# Altium schematic sheet ADC5G_FRONTEND.SchDoc: FMC 5GS/s ADC/TDC
size 420 x 297 mm; Author: Agnieszka Bartkowicz; CompanyName: WUT ISE; DrawnBy: Agnieszka Bartkowicz; Engineer: Agnieszka Bartkowicz; Organization: WUT ISE; Address1: PW ISE; Address2: Nowowiejska 15/19 00-665 Warsaw; Address3: gyorka@o2.pl; SheetNumber: 3; SheetTotal: 14; ModifiedBy: -; CheckedDate: -; Title2: Title 2; DivGrp: WUT ISE; Designer: A. Bartkowicz
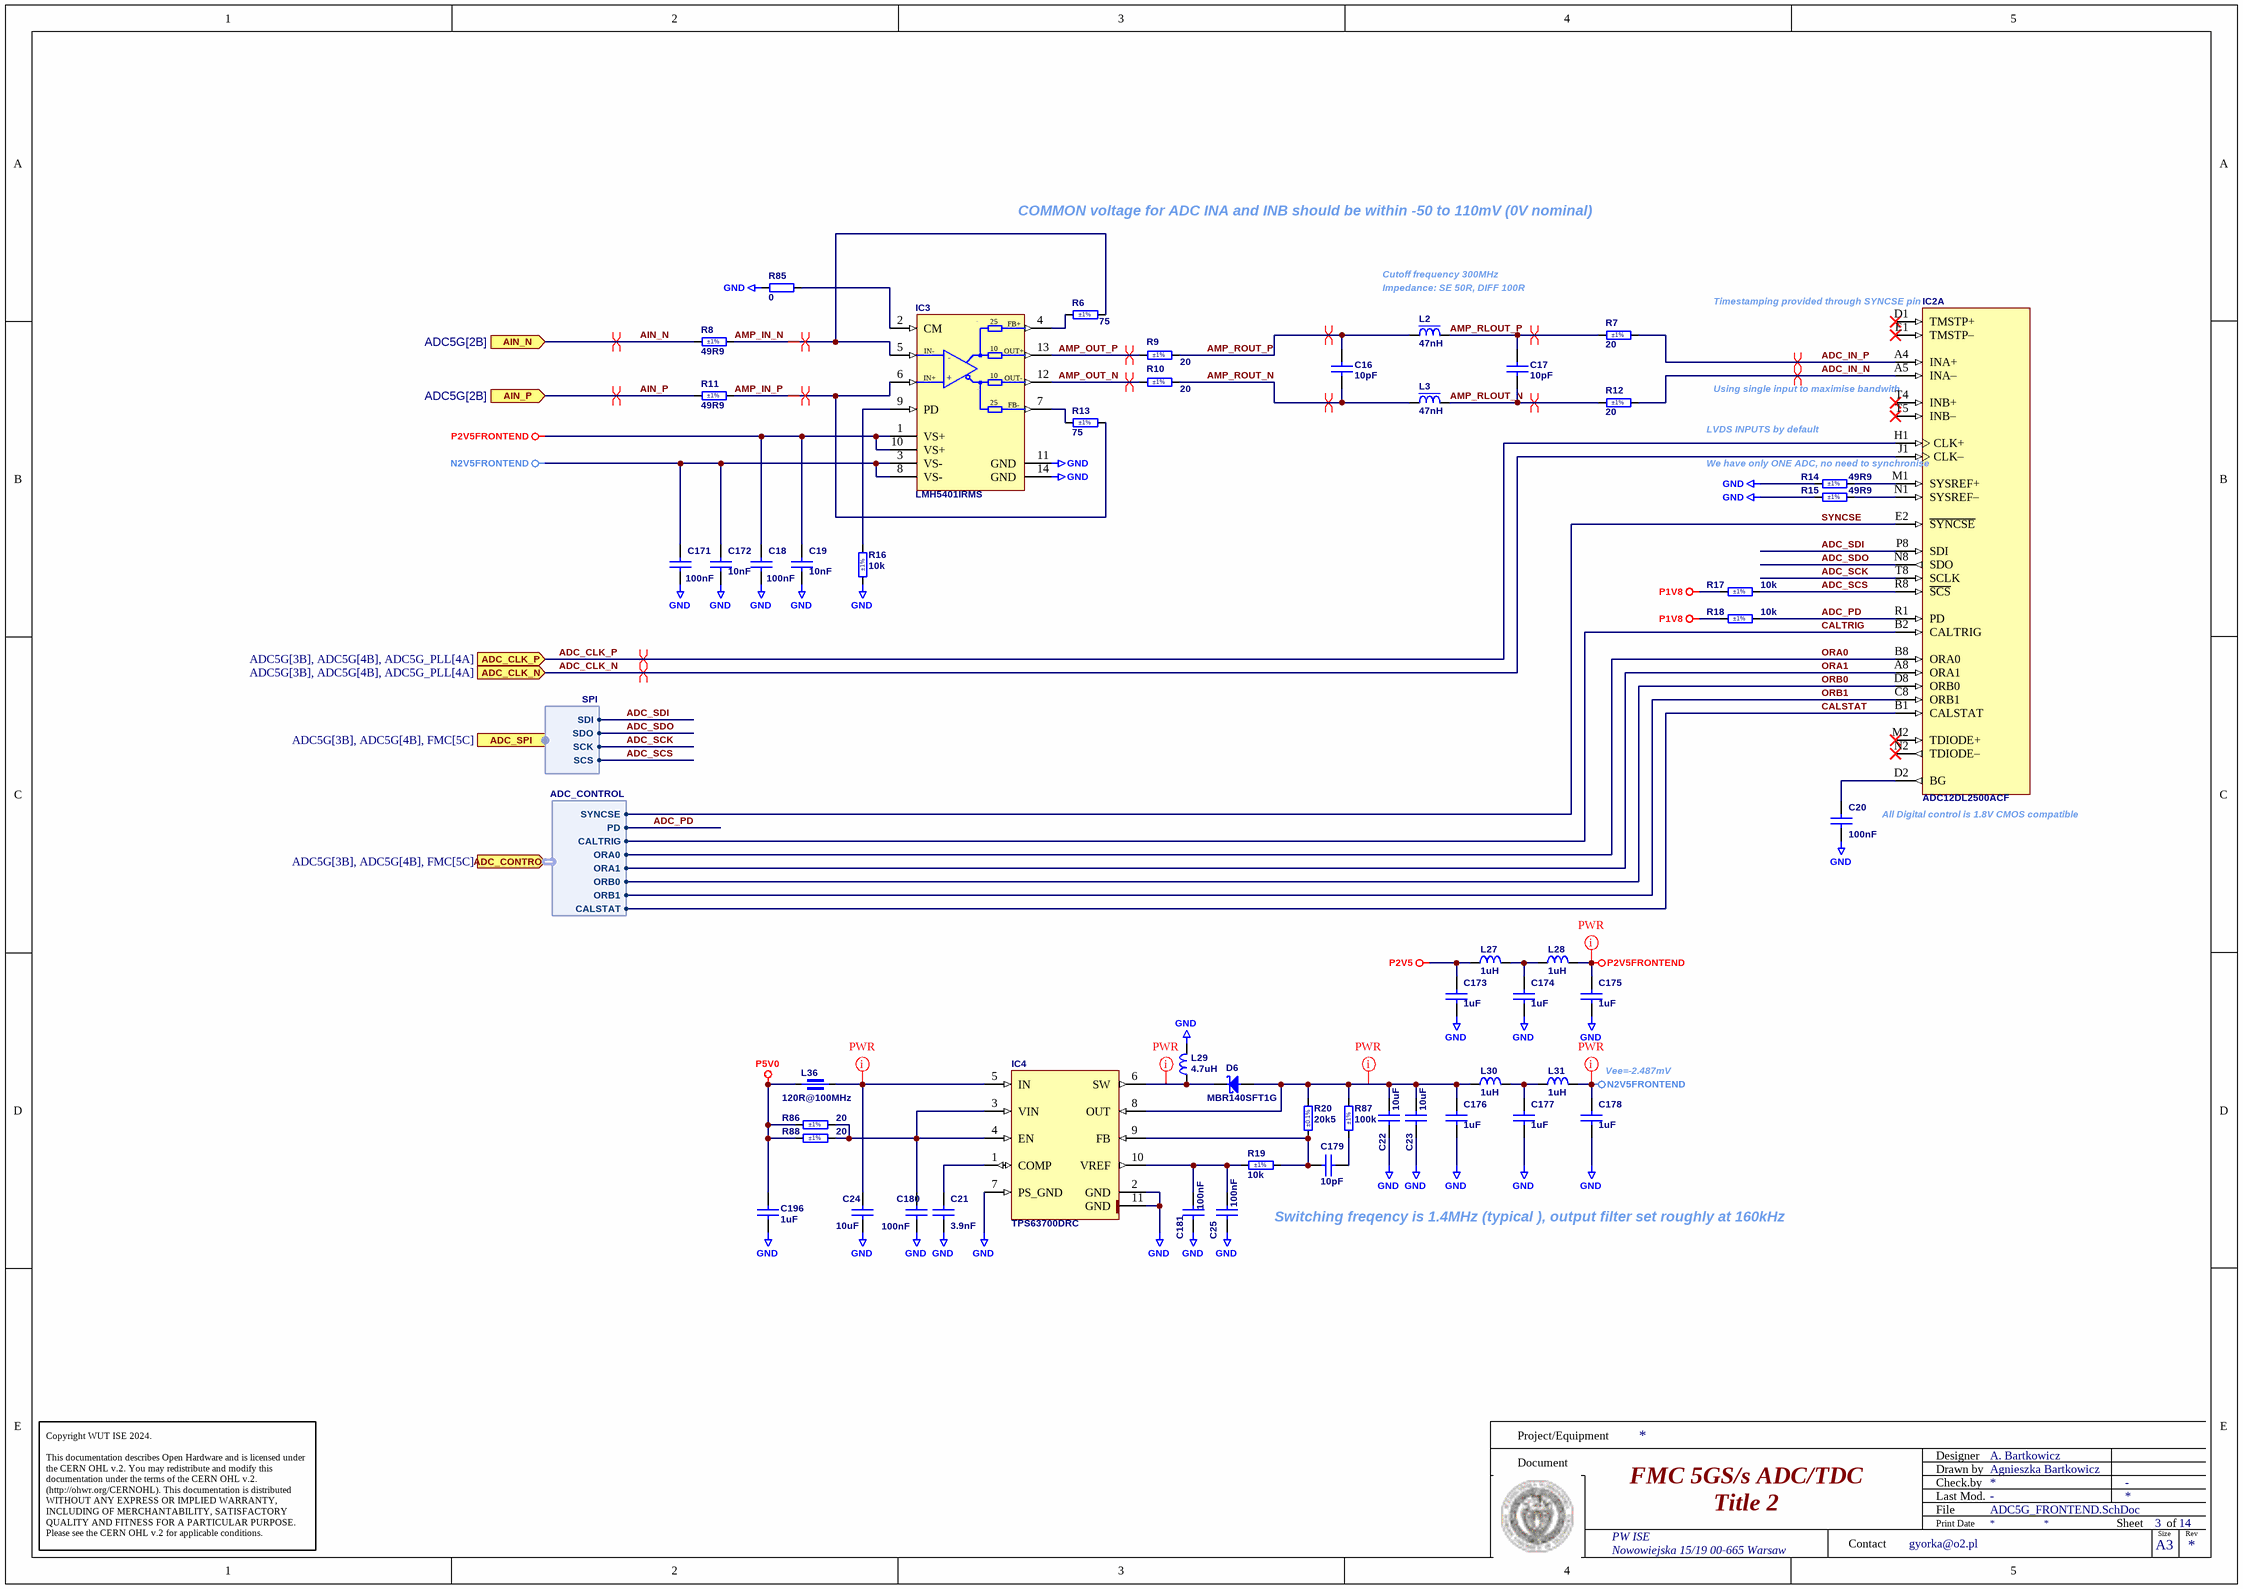
[diagram p0: ADC5G_FRONTEND.SchDoc]

## Parts
C16  10pF  [CAPC1005X55N]
C17  10pF  [CAPC1005X55N]
C18  100nF  [CAPC1005X55N]
C19  10nF  [CAPC1005X55N]
C20  100nF  [CAPC0603X33N]
C21  3.9nF  [CAPC1005X55N]
C22  10uF  [CAPC1608X90N]
C23  10uF  [CAPC1608X90N]
C24  10uF  [CAPC1608X90N]
C25  100nF  [CAPC1005X55N]
C171  100nF  [CAPC1005X55N]
C172  10nF  [CAPC1005X55N]
C173  1uF  [CAPC1005X55N]
C174  1uF  [CAPC1005X55N]
C175  1uF  [CAPC1005X55N]
C176  1uF  [CAPC1005X55N]
C177  1uF  [CAPC1005X55N]
C178  1uF  [CAPC1005X55N]
C179  10pF  [CAPC1005X55N]
C180  100nF  [CAPC1005X55N]
C181  100nF  [CAPC1005X55N]
C196  1uF  [CAPC1005X55N]
D6  MBR140SFT1G  [SOD-123FL]
IC2  ADC12DL2500ACF  [BGA256C100P16X16_1700X1700X331]  (part A of 7)
IC3  LMH5401IRMS  [QFN50P250X250X60-14N]
IC4  TPS63700DRC  [TEXAS_DRC (S-PVSON-N10)]
L2  47nH  [IND_MURATA_LQW15AN_00]
L3  47nH  [IND_MURATA_LQW15AN_00]
L27  1uH  [INDC2012X110N]
L28  1uH  [INDC2012X110N]
L29  4.7uH  [IND_COILCRAFT_EPL3015]
L30  1uH  [INDC2012X110N]
L31  1uH  [INDC2012X110N]
L36  120R@100MHz  [INDC1005X55N]
R6  75  Tolerance: ±1%  [RESC1005X40N]
R7  20  Tolerance: ±1%  [RESC1005X40N]
R8  49R9  Tolerance: ±1%  [RESC1005X40N]
R9  20  Tolerance: ±1%  [RESC1005X40N]
R10  20  Tolerance: ±1%  [RESC1005X40N]
R11  49R9  Tolerance: ±1%  [RESC1005X40N]
R12  20  Tolerance: ±1%  [RESC1005X40N]
R13  75  Tolerance: ±1%  [RESC1005X40N]
R14  49R9  Tolerance: ±1%  [RESC1005X40N]
R15  49R9  Tolerance: ±1%  [RESC1005X40N]
R16  10k  Tolerance: ±1%  [RESC1005X40N]
R17  10k  Tolerance: ±1%  [RESC1005X40N]
R18  10k  Tolerance: ±1%  [RESC1005X40N]
R19  10k  Tolerance: ±1%  [RESC1005X40N]
R20  20k5  Tolerance: ±0.1%  [RESC1608X55N]
R85  0  [RESC1005X40N]
R86  20  Tolerance: ±1%  [RESC1005X40N]
R87  100k  Tolerance: ±1%  [RESC1005X40N]
R88  20  Tolerance: ±1%  [RESC1005X40N]

## Ports
ADC_CLK_N (in, see ADC5G[3B], ADC5G[4B], ADC5G_PLL[4A]), ADC_CLK_P (in, see ADC5G[3B], ADC5G[4B], ADC5G_PLL[4A]), ADC_CONTROL (in, harness ADC_CONTROL, see ADC5G[3B], ADC5G[4B], FMC[5C]), ADC_SPI (in, harness SPI, see ADC5G[3B], ADC5G[4B], FMC[5C]), AIN_N (in, see ADC5G[2B]), AIN_P (in, see ADC5G[2B])

## Harnesses
SPI: SDI, SDO, SCK, SCS
ADC_CONTROL: SYNCSE, PD, CALTRIG, ORA0, ORA1, ORB0, ORB1, CALSTAT

## Nets
GND: C18.1 C19.1 C20.1 C21.1 C22.1 C23.1 C24.1 C25.1 C171.1 C172.1 C173.1 C174.1 C175.1 C176.1 C177.1 C178.1 C180.1 C181.1 C196.1 IC3.11(GND) IC3.14(GND) IC4.2(GND) IC4.7(PS_GND) IC4.11(GND) L29.2 R14.1 R15.1 R16.1 R85.1
N2V5FRONTEND: C171.2 C172.2 C178.2 IC3.3(VS-) IC3.8(VS-) L31.2
P1V8: R17.1 R18.1
P2V5: C173.2 L27.1
P2V5FRONTEND: C18.2 C19.2 C175.2 IC3.1(VS+) IC3.10(VS+) L28.2
P5V0: C196.2 L36.1 R86.2 R88.2
ADC_SCS: IC2.R8(~{SCS}) R17.2 ; port ADC_SPI.SCS
SYNCSE: IC2.E2(~{SYNCSE}) ; port ADC_CONTROL.SYNCSE
ADC_CLK_N: IC2.J1(CLK–) ; port ADC_CLK_N
ADC_CLK_P: IC2.H1(CLK+) ; port ADC_CLK_P
ADC_IN_N: IC2.A5(INA–) R12.2
ADC_IN_P: IC2.A4(INA+) R7.2
ADC_PD: IC2.R1(PD) R18.2 ; port ADC_CONTROL.PD
ADC_SCK: IC2.T8(SCLK) ; port ADC_SPI.SCK
ADC_SDI: IC2.P8(SDI) ; port ADC_SPI.SDI
ADC_SDO: IC2.N8(SDO) ; port ADC_SPI.SDO
AIN_N: R8.1 ; port AIN_N
AIN_P: R11.1 ; port AIN_P
AMP_IN_N: IC3.5(IN-) R6.2 R8.2
AMP_IN_P: IC3.6(IN+) R11.2 R13.2
AMP_OUT_N: IC3.12(OUT-) R10.1
AMP_OUT_P: IC3.13(OUT+) R9.1
AMP_RLOUT_N: C17.1 L3.2 R12.1
AMP_RLOUT_P: C17.2 L2.2 R7.1
AMP_ROUT_N: C16.1 L3.1 R10.2
AMP_ROUT_P: C16.2 L2.1 R9.2
CALSTAT: IC2.B1(CALSTAT) ; port ADC_CONTROL.CALSTAT
CALTRIG: IC2.B2(CALTRIG) ; port ADC_CONTROL.CALTRIG
ORA0: IC2.B8(ORA0) ; port ADC_CONTROL.ORA0
ORA1: IC2.A8(ORA1) ; port ADC_CONTROL.ORA1
ORB0: IC2.D8(ORB0) ; port ADC_CONTROL.ORB0
ORB1: IC2.C8(ORB1) ; port ADC_CONTROL.ORB1
NetC20_2: C20.2 IC2.D2(BG)
NetC21_2: C21.2 IC4.1(COMP)
NetC22_2: C22.2 C23.2 C176.2 D6.2(A) IC4.8(OUT) L30.1 R20.1 R87.2
NetC24_2: C24.2 IC4.5(IN) L36.2
NetC25_2: C25.2 C181.2 IC4.10(VREF) R19.1
NetC174_2: C174.2 L27.2 L28.1
NetC177_2: C177.2 L30.2 L31.1
NetC179_1: C179.1 IC4.9(FB) R19.2 R20.2
NetC179_2: C179.2 R87.1
NetC180_2: C180.2 IC4.3(VIN) IC4.4(EN) R86.1 R88.1
NetD6_1: D6.1(C) IC4.6(SW) L29.1
NetIC2_M1: IC2.M1(SYSREF+) R14.2
NetIC2_N1: IC2.N1(SYSREF–) R15.2
NetIC3_2: IC3.2(CM) R85.2
NetIC3_4: IC3.4(FB+) R6.1
NetIC3_7: IC3.7(FB-) R13.1
NetIC3_9: IC3.9(PD) R16.2

Not connected (* = marked no-connect by the designer): IC2 D1(TMSTP+)* E1(TMSTP–)* M2(TDIODE+)* N2(TDIODE–)* T4(INB+)* T5(INB–)*

## Layout directives
differential pair: ADC_CLK_N, ADC_CLK_P, ADC_IN_N, ADC_IN_P, AIN_N, AIN_P, AMP_IN_N, AMP_IN_P, AMP_OUT_N, AMP_OUT_P, AMP_RLOUT_N, AMP_RLOUT_P, AMP_ROUT_N, AMP_ROUT_P
net class PWR: N2V5FRONTEND, NetC22_2, NetC24_2, NetD6_1, P2V5FRONTEND

## Notes on the sheet
- COMMON voltage for ADC INA and INB should be within -50 to 110mV (0V nominal)
- Cutoff frequency 300MHz
- (near L2) Impedance: SE 50R, DIFF 100R
- (near IC2) Timestamping provided through SYNCSE pin
- (near IC2) Using single input to maximise bandwith
- LVDS INPUTS by default
- (near IC2) We have only ONE ADC, no need to synchronise
- All Digital control is 1.8V CMOS compatible
- Vee=-2.487mV
- Switching freqency is 1.4MHz (typical ), output filter set roughly at 160kHz
- Project/Equipment
- Document
- Designer
- Drawn by
- Check.by
- Copyright WUT ISE 2024.
  This documentation describes Open Hardware and is licensed under the CERN OHL v.2. You may redistribute and modify this documentation under the terms of the CERN OHL v.2. (http://ohwr.org/CERNOHL). This documentation is distributed WITHOUT ANY EXPRESS OR IMPLIED WARRANTY, INCLUDING OF MERCHANTABILITY, SATISFACTORY QUALITY AND FITNESS FOR A PARTICULAR PURPOSE. Please see the CERN OHL v.2 for applicable conditions.
- Contact
- File
- Last Mod.
- Print Date
- Sheet
- Size
- A3
- of
- Rev
- (in symbol LMH5401IRMS) 25; -; +

## Library data of the parts
C16 C17 C179 = CC0402_10PF_50V_5%_C0G: Non-polarised capacitor; Part Description: SMD Multilayer Chip Ceramic Capacitor; Manufacturer: GENERIC; Manufacturer1 Part Number: C0402C100J5GACTU; Voltage: 50V; TC: C0G/NP0; Tolerance: ±5%; Part Number: CC0402_10PF_50V_5%_C0G; Component Kind: Standard; Component Type: Standard; Pin Count: 2; Value: 10pF; Status: Preferred; Manufacturer Part Number: CC0402_10PF_50V_5%_C0G; Case: 0402; Mounted: Yes; Socket: No; SMD: Yes; Sense: No; Manufacturer1 Example: KEMET; Manufacturer1 ComponentHeight: 0.55mm; HelpURL: \\cern.ch\dfs\Applications\Altium\Datasheets\CC0402_C0G_KEMET_(Commercial Grade).pdf; Author: CERN DEM JLC; CreateDate: 03.12.2007; LatestRevisionDate: 22.04.2015
C18 C25 C171 C180 C181 = CC0402_100NF_16V_10%_X5R: Non-polarised capacitor; Part Description: SMD Multilayer Chip Ceramic Capacitor; Manufacturer: GENERIC; Manufacturer1 Part Number: GRM155R61C104KA88D; Voltage: 16V; TC: X5R; Tolerance: ±10%; Part Number: CC0402_100NF_16V_10%_X5R; Component Kind: Standard; Component Type: Standard; Pin Count: 2; Value: 100nF; Status: None; Manufacturer Part Number: CC0402_100NF_16V_10%_X5R; Case: 0402; Mounted: Yes; Socket: No; SMD: Yes; Sense: No; Manufacturer1 Example: MURATA; Manufacturer1 ComponentHeight: 0.55mm; HelpURL: \\cern.ch\dfs\Applications\Altium\Datasheets\CC0402_X5R_MURATA_GRM.pdf; Author: CERN DEM JLC; CreateDate: 10.12.2013; LatestRevisionDate: 10.12.2013
C19 C172 = CC0402_10NF_50V_10%_X7R: Non-polarised capacitor; Part Description: SMD Multilayer Chip Ceramic Capacitor; Manufacturer: GENERIC; Manufacturer1 Part Number: GRM155R71H103KA88D; Voltage: 50V; TC: X7R; Tolerance: ±10%; Part Number: CC0402_10NF_50V_10%_X7R; Component Kind: Standard; Component Type: Standard; Pin Count: 2; Value: 10nF; Status: None; Manufacturer Part Number: CC0402_10NF_50V_10%_X7R; Case: 0402; Mounted: Yes; Socket: No; SMD: Yes; Sense: No; Manufacturer1 Example: MURATA; Manufacturer1 ComponentHeight: 0.55mm; HelpURL: \\cern.ch\dfs\Applications\Altium\Datasheets\CC0402_X7R_MURATA_GRM.pdf; Author: CERN DEM MR; CreateDate: 08.01.2016; LatestRevisionDate: 08.01.2016
C20 = CC0201_100NF_6.3V_10%_X7R: Non-polarised capacitor; Part Description: SMD Multilayer Chip Ceramic Capacitor; Manufacturer: GENERIC; Manufacturer1 Part Number: CC0201KRX7R5BB104; Voltage: 6.3V; TC: X7R; Tolerance: ±10%; Part Number: CC0201_100NF_6.3V_10%_X7R; Component Kind: Standard; Component Type: Standard; Pin Count: 2; Value: 100nF; Status: Not Recommended; Manufacturer Part Number: CC0201_100NF_6.3V_10%_X7R; Case: 0201; Mounted: Yes; Socket: No; SMD: Yes; Sense: No; Manufacturer1 Example: YAGEO PHYCOMP; Manufacturer1 ComponentHeight: 0.33mm; HelpURL: \\cern.ch\dfs\Applications\Altium\Datasheets\CC0201_X7R_YAGEO_6.3VTO50V.pdf; Author: CERN DEM BC; CreateDate: 20.11.2020; LatestRevisionDate: 20.11.2020
C21 = CC0402_3.9NF_50V_5%_X7R: Non-polarised capacitor; Part Description: SMD Multilayer Chip Ceramic Capacitor; Manufacturer: GENERIC; Manufacturer1 Part Number: CC0402JRX7R9BB392; Voltage: 50V; TC: X7R; Tolerance: ±5%; Part Number: CC0402_3.9NF_50V_5%_X7R; Component Kind: Standard; Component Type: Standard; Pin Count: 2; Value: 3.9nF; Status: Preferred; Manufacturer Part Number: CC0402_3.9NF_50V_5%_X7R; Case: 0402; Mounted: Yes; Socket: No; SMD: Yes; Sense: No; Manufacturer1 Example: YAGEO PHYCOMP; Manufacturer1 ComponentHeight: 0.55mm; HelpURL: \\cern.ch\dfs\Applications\Altium\Datasheets\CC0402_X7R_YAGEO_6.3VTO50V.pdf; Author: CERN DEM BC; CreateDate: 14.07.2020; LatestRevisionDate: 14.07.2020
C22-C24 = CC0603_10UF_16V_10%_X5R_MURATA_GRT188R61C106KE13: Non-polarised capacitor; Part Description: AEC-Q200 Compliant Chip Multilayer Ceramic Capacitor; Manufacturer: MURATA; Voltage: 16V; TC: X5R; Tolerance: ±10%; Part Number: CC0603_10UF_16V_10%_X5R_MURATA_GRT188R61C106KE13; Component Kind: Standard; Component Type: Standard; Pin Count: 2; Value: 10uF; Status: None; Manufacturer Part Number: GRT188R61C106KE13; Case: 0603; Mounted: Yes; Socket: No; SMD: Yes; Sense: No; ComponentHeight: 0.9mm; HelpURL: \\cern.ch\dfs\Applications\Altium\Datasheets\CC0603_MURATA_GRT188R61C106KE13.pdf; Author: CERN DEM HF; CreateDate: 16.06.2022; LatestRevisionDate: 17.06.2022
C173-C178 = CC0402_1UF_16V_10%_X5R: Non-polarised capacitor; Part Description: SMD Multilayer Chip Ceramic Capacitor; Manufacturer: GENERIC; Manufacturer1 Part Number: C1005X5R1C105KT; Voltage: 16V; TC: X5R; Tolerance: ±10%; Part Number: CC0402_1UF_16V_10%_X5R; Component Kind: Standard; Component Type: Standard; Pin Count: 2; Value: 1uF; Status: Preferred; Manufacturer Part Number: CC0402_1UF_16V_10%_X5R; Case: 0402; Mounted: Yes; Socket: No; SMD: Yes; Sense: No; Manufacturer1 Example: TDK; Manufacturer1 ComponentHeight: 0.55mm; HelpURL: \\cern.ch\dfs\Applications\Altium\Datasheets\CC0402_X5R_TDK_C.pdf; Author: CERN DEM JLC; CreateDate: 25.10.2012; LatestRevisionDate: 25.10.2012
C196 = CC0402_1UF_25V_10%_X5R: Non-polarised capacitor; Part Description: SMD Multilayer Chip Ceramic Capacitor; Manufacturer: GENERIC; Manufacturer1 Part Number: C1005X5R1E105K050; Voltage: 25V; TC: X5R; Tolerance: ±10%; Part Number: CC0402_1UF_25V_10%_X5R; Component Kind: Standard; Component Type: Standard; Pin Count: 2; Value: 1uF; Status: Preferred; Manufacturer Part Number: CC0402_1UF_25V_10%_X5R; Case: 0402; Mounted: Yes; Socket: No; SMD: Yes; Sense: No; Manufacturer1 Example: TDK; Manufacturer1 ComponentHeight: 0.55mm; HelpURL: \\cern.ch\dfs\Applications\Altium\Datasheets\CC0402_X5R_TDK_C.pdf; Author: CERN DEM BC; CreateDate: 17.02.2020; LatestRevisionDate: 17.02.2020
D6 = MBR140SFT1G: Schottky Diode; Part Description: Schottky Power Rectifier; Manufacturer: ON SEMICONDUCTOR; Voltage: 40V; Power: 1A; PressFit: No; Bonding: No; Part Number: MBR140SFT1G; Component Kind: Standard; Component Type: Standard; Device: MBR140SFT1G; PackageDescription: Small Outline Diode Flat Lead (SOD-123FL), Body; 2.70mm L X 1.65mm W X 1.0mm H; Manufacturer Part Number: MBR140SF; Pin Count: 2; Case: SOD-123FL; Mounted: Yes; Socket: No; SMD: Yes; Sense: No; ComponentHeight: 1.0mm; HelpURL: \\cern.ch\dfs\Applications\Altium\Datasheets\MBR140SFT1G.pdf; Author: CERN DEM JLC; CreateDate: 06.04.2009; LatestRevisionDate: 24.05.2022
IC2 = ADC12DL2500ACF: Single-Supply, Multichannel, 125kSPS, 24-Bit, Sigma-Delta ADC with ±10V Inputs; Part Description: 1.5 GSPS Dual-Channel or 1, 3, 5GSPS Single-Channel,12-Bit Analog-to-Digital Converters (ADC) With LVDS Interface; Manufacturer: TEXAS INSTRUMENTS; PressFit: No; Bonding: No; Part Number: ADC12DL2500ACF; Component Kind: Standard; Component Type: Standard; Device: ADC12DL2500ACF; PackageDescription: BGA, 1.00mm Pitch, Square; 156 Pin, 16 Columns X 16 Rows, 17.0mm X 17.0mm X 3.31mm H body, IPC Medium Density; Manufacturer Part Number: ADC12DL2500ACF; Pin Count: 256; Case: BGA256; Mounted: Yes; Socket: No; SMD: Yes; Sense: No; ComponentHeight: 3.31mm; Author: CERN DEM HF; HelpURL: \\cern.ch\dfs\Applications\Altium\Datasheets\ADC12DLX500ACF.pdf; CreateDate: 04.12.2024; LatestRevisionDate: 04.12.2024
IC3 = LMH5401IRMS: Low-Noise, Low-Power, 8-GHz Fully Differential Amplifier; Manufacturer: TEXAS INSTRUMENTS; PressFit: No; Bonding: No; Part Number: LMH5401IRMS; Component Kind: Standard; Component Type: Standard; Device: LMH5401IRMS; PackageDescription: QFN, 0.50mm Pitch, Square, 14 pin, 2.50mm L X 2.50mm W X 0.60mm H body, IPC Medium Density; Part Description: Low-Noise, Low-Power, 8-GHz Fully Differential Amplifier; Manufacturer Part Number: LMH5401IRMS; Pin Count: 14; Case: QFN14; Mounted: Yes; Socket: No; SMD: Yes; Sense: No; ComponentHeight: 0.6mm; Author: CERN DEM MR; HelpURL: \\cern.ch\dfs\Applications\Altium\Datasheets\LMH5401IRMS.pdf; CreateDate: 08.08.2019; LatestRevisionDate: 08.08.2019
IC4 = TPS63700DRC: DC-DC Inverter; Manufacturer: TEXAS INSTRUMENTS; PressFit: No; Bonding: No; Part Number: TPS63700DRC; Component Kind: Standard; Component Type: Standard; Device: TPS63700DRC; PackageDescription: TEXAS Case Style DRC (S-PVSON-N10), SON, 0.50mm Pitch; 10 Pin, 3.00mm W  X 3.00mm L X 1.00mm H body, (w/Thermal Tab 1.75 X 2.50 mm); Part Description: DC-DC Inverter; Manufacturer Part Number: TPS63700DRC; Pin Count: 11; Case: SON10; Mounted: Yes; Socket: No; SMD: Yes; Sense: No; ComponentHeight: 1mm; HelpURL: \\cern.ch\dfs\Applications\Altium\Datasheets\TPS63700DRC.pdf; Author: CERN DEM BC; CreateDate: 18.05.2020; LatestRevisionDate: 18.05.2020
L2 L3 = IND0402_47NH_2%_MURATA_LQW15AN47NG00: Inductor With Core; Part Description: Wire Wound RF Inductor; Manufacturer: MURATA; Power: 210mA; Resistance: 1R08; Tolerance: ±2%; Part Number: IND0402_47NH_2%_MURATA_LQW15AN47NG00; Component Kind: Standard; Component Type: Standard; Pin Count: 2; Value: 47nH; Manufacturer Part Number: LQW15AN47NG00; Case: 0402; Mounted: Yes; Socket: No; SMD: Yes; Sense: No; ComponentHeight: 0.6mm; HelpURL: \\cern.ch\dfs\Applications\Altium\Datasheets\IND_MURATA_LQW15AN47NG00.pdf; Author: CERN DEM HF; CreateDate: 05.08.2022; LatestRevisionDate: 05.08.2022
L27 L28 L30 L31 = IND0805_1UH_20%_WURTH_74479775210: Inductor; Part Description: SMD-Power Inductance (WE-PMI Series); Manufacturer: WURTH ELEKTRONIK; Power: 800mA; Resistance: 0.1R; Tolerance: ±20%; Part Number: IND0805_1UH_20%_WURTH_74479775210; Component Kind: Standard; Component Type: Standard; Pin Count: 2; Value: 1uH; Manufacturer Part Number: 74479775210; Case: 0805; Mounted: Yes; Socket: No; SMD: Yes; Sense: No; ComponentHeight: 1.2mm; HelpURL: \\cern.ch\dfs\Applications\Altium\Datasheets\IND0805_WURTH_74479775210.pdf; Author: CERN DEM JLC; CreateDate: 10.10.2012; LatestRevisionDate: 08.04.2014
L29 = IND_4.7UH_20%_COILCRAFT_EPL3015: Inductor; Part Description: Shielded SMD Power Inductor; Manufacturer Part Number: EPL3015-472ML; Power: 1A; Resistance: 0.145R; Tolerance: ±20%; Part Number: IND_4.7UH_20%_COILCRAFT_EPL3015; Component Kind: Standard; Component Type: Standard; Pin Count: 2; Value: 4.7uH; Manufacturer: COILCRAFT; Mounted: Yes; Socket: No; SMD: Yes; Sense: No; ComponentHeight: 1.55mm; HelpURL: \\cern.ch\dfs\Applications\Altium\Datasheets\IND_COILCRAFT_EPL3015.pdf; Author: CERN DEM BC; CreateDate: 27.02.2017; LatestRevisionDate: 27.02.2017
L36 = IND0402_MURATA_BLM15PX121SN1D: Part Description: SMD EMIFIL Chip Ferrite Bead; Manufacturer: MURATA; Power: 2A; Resistance: 0.055R; Tolerance: ±25%; Part Number: IND0402_MURATA_BLM15PX121SN1D; Component Kind: Standard; Component Type: Standard; Pin Count: 2; Value: 120R@100MHz; Manufacturer Part Number: BLM15PX121SN1D; Case: 0402; Mounted: Yes; Socket: No; SMD: Yes; Sense: No; ComponentHeight: 0.55mm; HelpURL: \\cern.ch\dfs\Applications\Altium\Datasheets\IND0402_MURATA_BLM15PX.pdf; Author: CERN DEM JMW; CreateDate: 19.02.2014; LatestRevisionDate: 25.10.2018
R6 R13 = R0402_75R_1%_0.0625W_100PPM: Resistor - 1%; Part Description: General Purpose Thick Film Chip Resistor; Manufacturer: GENERIC; Manufacturer1 Part Number: 232270677509L; TC: ±100ppm/°C; PressFit: No; Part Number: R0402_75R_1%_0.0625W_100PPM; Component Kind: Standard; Component Type: Standard; Pin Count: 2; Value: 75; Status: Not Recommended; Power: 0.0625W; Manufacturer Part Number: R0402_75R_1%_0.0625W_100PPM; Case: 0402; Mounted: Yes; Sense: No; Socket: No; SMD: Yes; Manufacturer1 Example: YAGEO PHYCOMP; Manufacturer1 ComponentHeight: 0.4mm; HelpURL: \\cern.ch\dfs\Applications\Altium\Datasheets\R0402_Phycomp_RC0402.pdf; Author: CERN DEM JLC; CreateDate: 03.12.2007; LatestRevisionDate: 17.10.2012
R7 R9 R10 R12 R86 R88 = R0402_20R_1%_0.0625W_100PPM: Resistor - 1%; Part Description: General Purpose Thick Film Chip Resistor; Manufacturer: GENERIC; Manufacturer1 Part Number: 232270672009L; TC: ±100ppm/°C; PressFit: No; Part Number: R0402_20R_1%_0.0625W_100PPM; Component Kind: Standard; Component Type: Standard; Pin Count: 2; Value: 20; Status: Not Recommended; Power: 0.0625W; Manufacturer Part Number: R0402_20R_1%_0.0625W_100PPM; Case: 0402; Mounted: Yes; Sense: No; Socket: No; SMD: Yes; Manufacturer1 Example: YAGEO PHYCOMP; Manufacturer1 ComponentHeight: 0.4mm; HelpURL: \\cern.ch\dfs\Applications\Altium\Datasheets\R0402_Phycomp_RC0402.pdf; Author: CERN DEM JLC; CreateDate: 03.12.2007; LatestRevisionDate: 17.10.2012
R8 R11 R14 R15 = R0402_49R9_1%_0.0625W_100PPM: Resistor - 1%; Part Description: General Purpose Thick Film Chip Resistor; Manufacturer: GENERIC; Manufacturer1 Part Number: 232270674999L or RC0402FR-0749R9L; TC: ±100ppm/°C; PressFit: No; Part Number: R0402_49R9_1%_0.0625W_100PPM; Component Kind: Standard; Component Type: Standard; Pin Count: 2; Value: 49R9; Status: Not Recommended; Power: 0.0625W; Manufacturer Part Number: R0402_49R9_1%_0.0625W_100PPM; Case: 0402; Mounted: Yes; Sense: No; Socket: No; SMD: Yes; Manufacturer1 Example: YAGEO PHYCOMP; Manufacturer1 ComponentHeight: 0.4mm; HelpURL: \\cern.ch\dfs\Applications\Altium\Datasheets\R0402_Phycomp_RC0402.pdf; Author: CERN DEM JLC; CreateDate: 24.10.2012; LatestRevisionDate: 24.10.2012
R16-R19 = R0402_10K_1%_0.0625W_100PPM: Resistor - 1%; Part Description: General Purpose Thick Film Chip Resistor; Manufacturer: GENERIC; Manufacturer1 Part Number: 232270671003L; TC: ±100ppm/°C; PressFit: No; Part Number: R0402_10K_1%_0.0625W_100PPM; Component Kind: Standard; Component Type: Standard; Pin Count: 2; Value: 10k; Status: Not Recommended; Power: 0.0625W; Manufacturer Part Number: R0402_10K_1%_0.0625W_100PPM; Case: 0402; Mounted: Yes; Sense: No; Socket: No; SMD: Yes; Manufacturer1 Example: YAGEO PHYCOMP; Manufacturer1 ComponentHeight: 0.4mm; HelpURL: \\cern.ch\dfs\Applications\Altium\Datasheets\R0402_Phycomp_RC0402.pdf; Author: CERN DEM JLC; CreateDate: 03.12.2007; LatestRevisionDate: 17.10.2012
R20 = R0603_20K5_0.1%_0.063W_10PPM: Resistor - 0.1%; Part Description: Thin Film Chip Resistor; Manufacturer: GENERIC; Manufacturer1 Part Number: RN73C1J20K5BTDF; Power: 0.063W; TC: ±10ppm; PressFit: No; Part Number: R0603_20K5_0.1%_0.063W_10PPM; Component Kind: Standard; Component Type: Standard; Pin Count: 2; Value: 20k5; Status: Not Recommended; Manufacturer Part Number: R0603_20K5_0.1%_0.063W_10PPM; Case: 0603; Mounted: Yes; Sense: No; Socket: No; SMD: Yes; Manufacturer1 Example: TYCO HOLSWORTHY; Manufacturer1 ComponentHeight: 0.5mm; HelpURL: \\cern.ch\dfs\Applications\Altium\Datasheets\R0603_Tyco_RN73.pdf; Author: CERN DEM JLC; CreateDate: 03.12.2007; LatestRevisionDate: 13.03.2008
R85 = R0402_0R_JUMPER: Resistor; Part Description: 1A (0.05R Max DC Resistance) Zero Ohm Jumper; Manufacturer: GENERIC; Manufacturer1 Part Number: 232270591001L; PressFit: No; Part Number: R0402_0R_JUMPER; Component Kind: Standard; Component Type: Standard; Pin Count: 2; Value: 0; Status: Not Recommended; Manufacturer Part Number: R0402_0R_JUMPER; Case: 0402; Mounted: Yes; Sense: No; Socket: No; SMD: Yes; Manufacturer1 Example: YAGEO PHYCOMP; Manufacturer1 ComponentHeight: 0.4mm; HelpURL: \\cern.ch\dfs\Applications\Altium\Datasheets\R0402_Phycomp_RC0402.pdf; Author: CERN DEM JLC; CreateDate: 03.12.2007; LatestRevisionDate: 17.10.2012
R87 = R0402_100K_1%_0.0625W_100PPM: Resistor - 1%; Part Description: General Purpose Thick Film Chip Resistor; Manufacturer: GENERIC; Manufacturer1 Part Number: 232270671004L; TC: ±100ppm/°C; PressFit: No; Part Number: R0402_100K_1%_0.0625W_100PPM; Component Kind: Standard; Component Type: Standard; Pin Count: 2; Value: 100k; Status: Not Recommended; Power: 0.0625W; Manufacturer Part Number: R0402_100K_1%_0.0625W_100PPM; Case: 0402; Mounted: Yes; Sense: No; Socket: No; SMD: Yes; Manufacturer1 Example: YAGEO PHYCOMP; Manufacturer1 ComponentHeight: 0.4mm; HelpURL: \\cern.ch\dfs\Applications\Altium\Datasheets\R0402_Phycomp_RC0402.pdf; Author: CERN DEM JLC; CreateDate: 03.12.2007; LatestRevisionDate: 17.10.2012